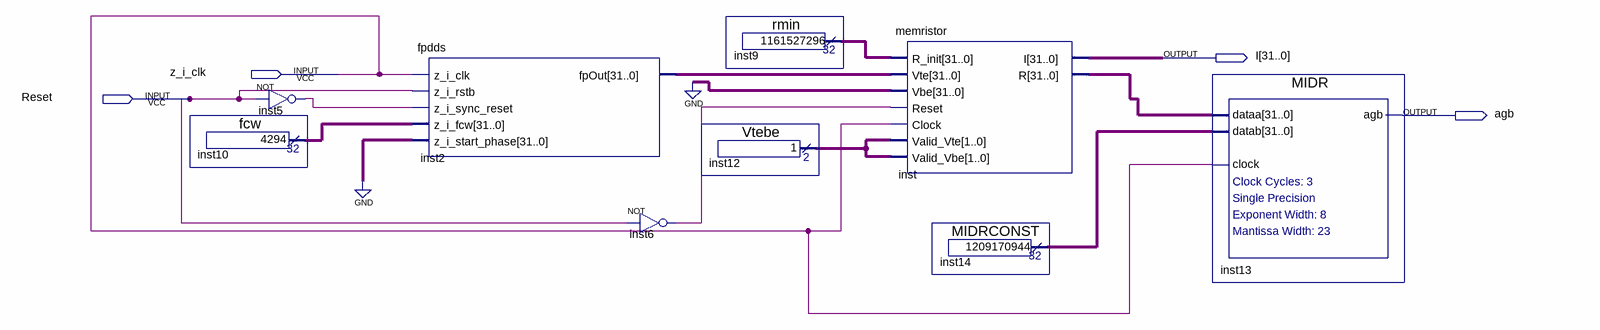
[diagram p0: schematic sheet]
// Quartus schematic memtesterFPGA.bdf as structural Verilog: 9 symbols, 4 pins
module memtesterFPGA (
  input  z_i_clk,
  input  Reset,
  output [31:0] I,
  output agb
);

  wire inst5_out, inst6_out;
  wire [1:0] inst12_result;
  wire [31:0] inst2_fpout, inst9_result, inst10_result, inst14_result, inst_r;

  fcw inst10 (.result(inst10_result));
  not inst5 (inst5_out, Reset);
  fpdds inst2 (
    .z_i_clk(z_i_clk), .z_i_rstb(Reset), .z_i_sync_reset(inst5_out), .z_i_fcw(inst10_result),
    .z_i_start_phase({32{1'b0}}), .fpOut(inst2_fpout));
  not inst6 (inst6_out, Reset);
  rmin inst9 (.result(inst9_result));
  Vtebe inst12 (.result(inst12_result));
  memristor inst (
    .R_init(inst9_result), .Vte(inst2_fpout), .Vbe({32{1'b0}}), .Reset(inst6_out), .Clock(z_i_clk),
    .Valid_Vte(inst12_result), .Valid_Vbe(inst12_result), .I(I), .R(inst_r));
  MIDRCONST inst14 (.result(inst14_result));
  MIDR inst13 (.dataa(inst_r), .datab(inst14_result), .clock(z_i_clk), .agb(agb));
endmodule
